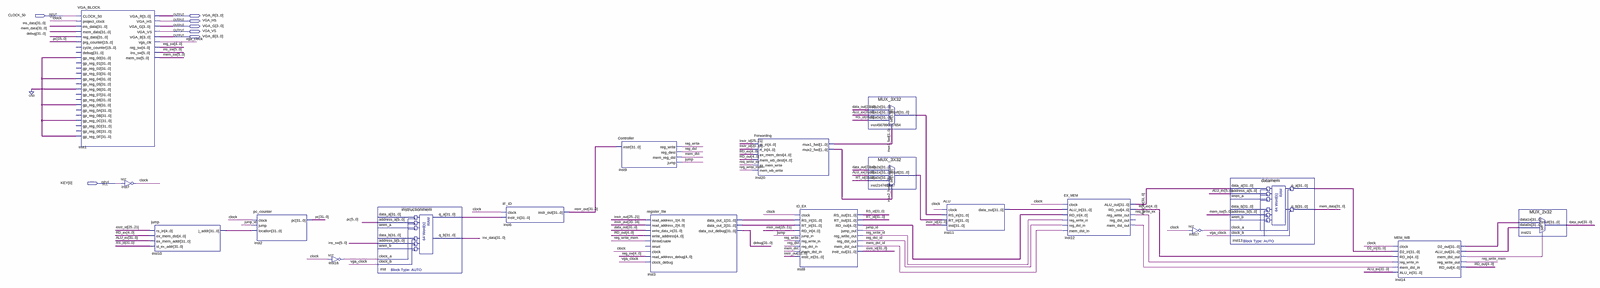
[diagram p0: schematic sheet, whole]
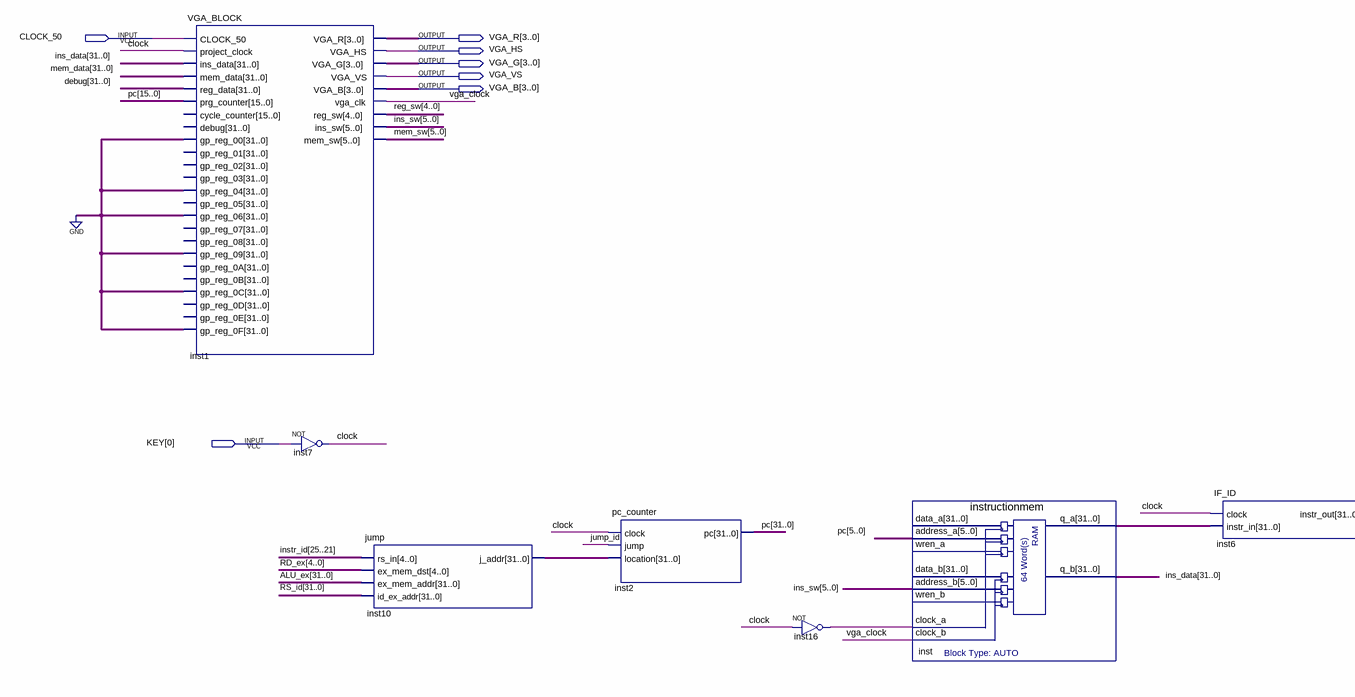
[diagram p1: schematic sheet, left part]
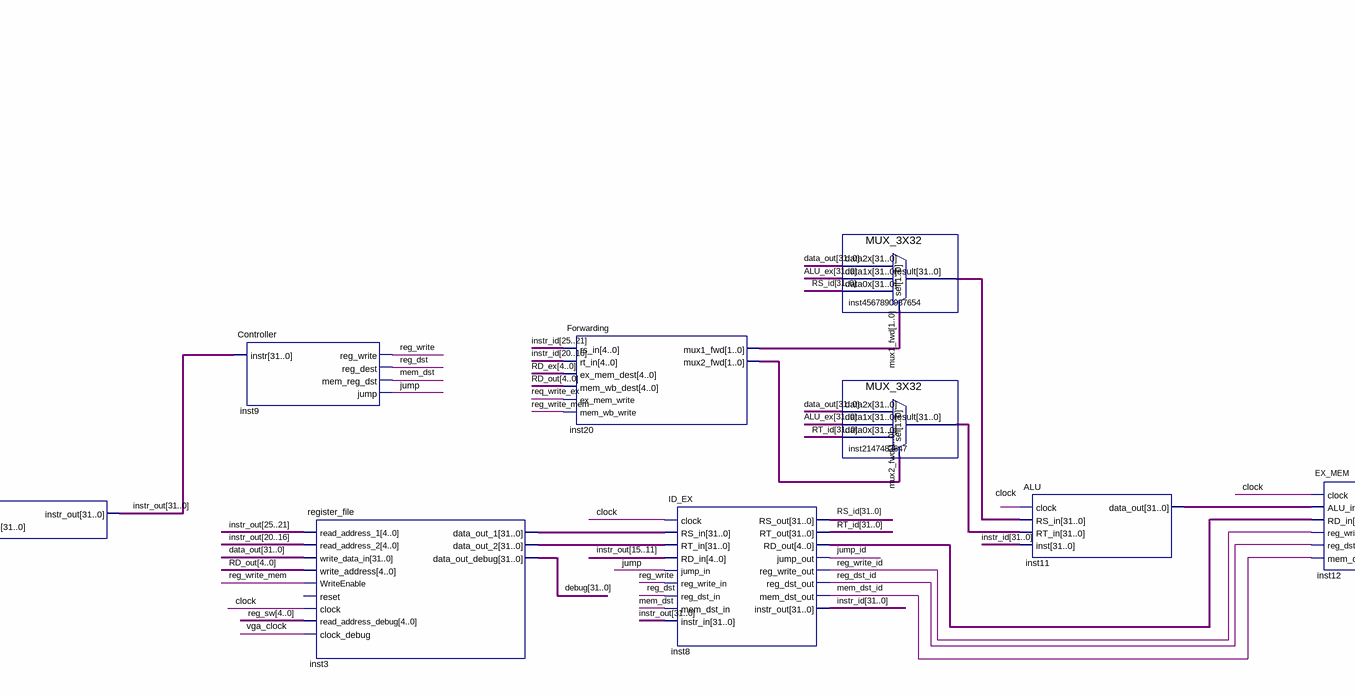
[diagram p2: schematic sheet, centre part]
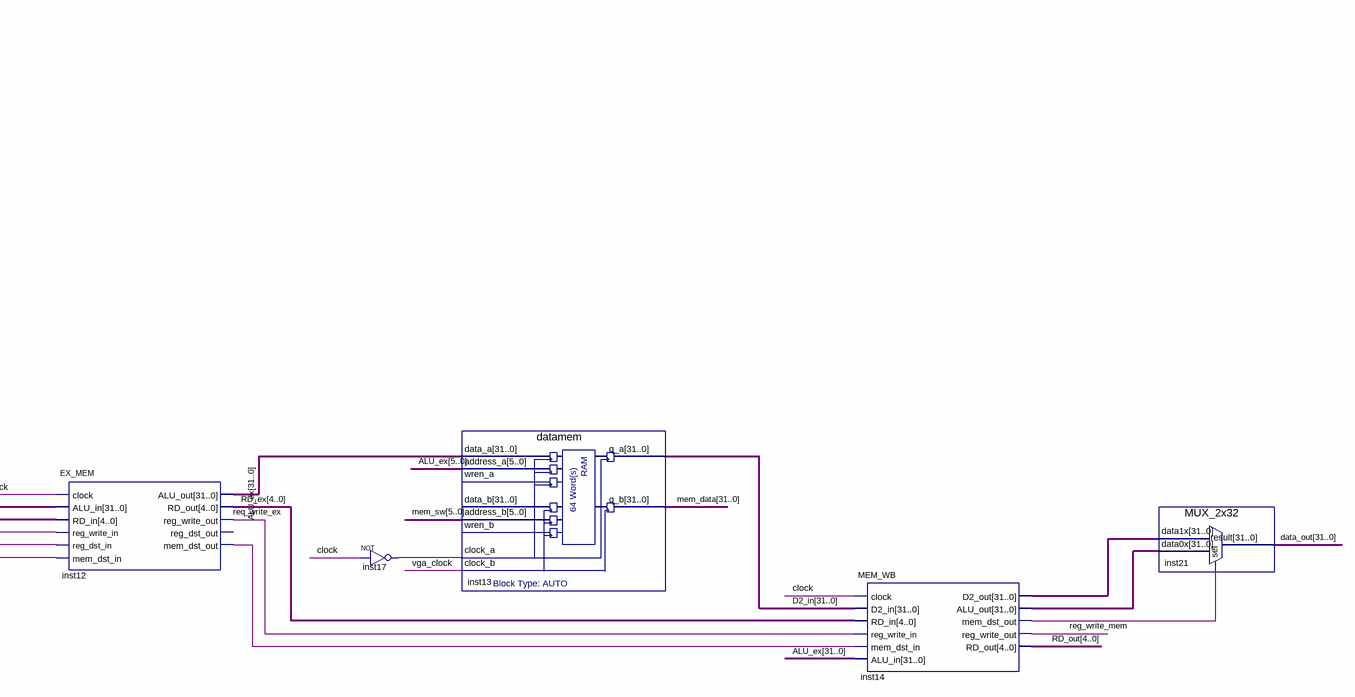
[diagram p3: schematic sheet, right part]
// Quartus schematic project.bdf as structural Verilog: 19 symbols, 7 pins
module project (
  input  CLOCK_50,
  input  [0:0] KEY,
  output [3:0] VGA_R,
  output VGA_HS,
  output [3:0] VGA_G,
  output VGA_VS,
  output [3:0] VGA_B
);

  wire clock, inst12_mem_dst_out, inst14_mem_dst_out, inst16_out, inst17_out, jump, jump_id, mem_dst,
       mem_dst_id, reg_dst, reg_dst_id, reg_write, reg_write_id, reg_write_mem, req_write_ex, vga_clock;
  wire [1:0] mux1_fwd, mux2_fwd;
  wire [4:0] inst8_rd_out, RD_ex, RD_out, reg_sw;
  wire [5:0] ins_sw, mem_sw;
  wire [31:0] ALU_ex, D2_in, data_out, debug, ins_data, inst3_data_out_1, inst3_data_out_2, inst10_j_addr,
       inst11_data_out, inst14_alu_out, inst14_d2_out, inst2147483647_result, inst4567890987654_result,
       inst_q_a, instr_id, instr_out, mem_data, pc, RS_id, RT_id;

  VGA_BLOCK inst1 (
    .CLOCK_50(CLOCK_50), .project_clock(clock), .ins_data(ins_data), .mem_data(mem_data), .reg_data(debug),
    .prg_counter(pc[15:0]), .gp_reg_00({32{1'b0}}), .gp_reg_04({32{1'b0}}), .gp_reg_06({32{1'b0}}),
    .gp_reg_09({32{1'b0}}), .gp_reg_0C({32{1'b0}}), .gp_reg_0F({32{1'b0}}), .VGA_R(VGA_R), .VGA_HS(VGA_HS),
    .VGA_G(VGA_G), .VGA_VS(VGA_VS), .VGA_B(VGA_B), .vga_clk(vga_clock), .reg_sw(reg_sw), .ins_sw(ins_sw),
    .mem_sw(mem_sw));  // open: cycle_counter, debug, gp_reg_01, gp_reg_02, gp_reg_03, gp_reg_05, gp_reg_07, gp_reg_08, gp_reg_0A, gp_reg_0B, gp_reg_0D, gp_reg_0E
  not inst7 (clock, KEY[0]);
  jump inst10 (
    .rs_in(instr_id[25:21]), .ex_mem_dst(RD_ex), .ex_mem_addr(ALU_ex), .id_ex_addr(RS_id),
    .j_addr(inst10_j_addr));
  pc_counter inst2 (.clock(clock), .jump(jump_id), .location(inst10_j_addr), .pc(pc));
  not inst16 (inst16_out, clock);
  instructionmem inst (
    .address_a(pc[5:0]), .address_b(ins_sw), .clock_a(inst16_out), .clock_b(vga_clock), .q_a(inst_q_a),
    .q_b(ins_data));  // open: data_a, wren_a, data_b, wren_b
  IF_ID inst6 (.clock(clock), .instr_in(inst_q_a), .instr_out(instr_out));
  Controller inst9 (.instr(instr_out), .reg_write(reg_write), .reg_dest(reg_dst), .mem_reg_dst(mem_dst), .jump(jump));
  register_file inst3 (
    .read_address_1(instr_out[25:21]), .read_address_2(instr_out[20:16]), .write_data_in(data_out),
    .write_address(RD_out), .WriteEnable(reg_write_mem), .clock(clock), .read_address_debug(reg_sw),
    .clock_debug(vga_clock), .data_out_1(inst3_data_out_1), .data_out_2(inst3_data_out_2),
    .data_out_debug(debug));  // open: reset
  Forwarding inst20 (
    .rs_in(instr_id[25:21]), .rt_in(instr_id[20:16]), .ex_mem_dest(RD_ex), .mem_wb_dest(RD_out),
    .ex_mem_write(req_write_ex), .mem_wb_write(reg_write_mem), .mux1_fwd(mux1_fwd), .mux2_fwd(mux2_fwd));
  ID_EX inst8 (
    .clock(clock), .RS_in(inst3_data_out_1), .RT_in(inst3_data_out_2), .RD_in(instr_out[15:11]),
    .jump_in(jump), .reg_write_in(reg_write), .reg_dst_in(reg_dst), .mem_dst_in(mem_dst),
    .instr_in(instr_out), .RS_out(RS_id), .RT_out(RT_id), .RD_out(inst8_rd_out), .jump_out(jump_id),
    .reg_write_out(reg_write_id), .reg_dst_out(reg_dst_id), .mem_dst_out(mem_dst_id), .instr_out(instr_id));
  MUX_3X32 inst4567890987654 (
    .data2x(data_out), .data1x(ALU_ex), .data0x(RS_id), .sel(mux1_fwd), .result(inst4567890987654_result));
  MUX_3X32 inst2147483647 (
    .data2x(data_out), .data1x(ALU_ex), .data0x(RT_id), .sel(mux2_fwd), .result(inst2147483647_result));
  ALU inst11 (
    .clock(clock), .RS_in(inst4567890987654_result), .RT_in(inst2147483647_result), .inst(instr_id),
    .data_out(inst11_data_out));
  EX_MEM inst12 (
    .clock(clock), .ALU_in(inst11_data_out), .RD_in(inst8_rd_out), .reg_write_in(reg_write_id),
    .reg_dst_in(reg_dst_id), .mem_dst_in(mem_dst_id), .ALU_out(ALU_ex), .RD_out(RD_ex),
    .reg_write_out(req_write_ex), .mem_dst_out(inst12_mem_dst_out));  // open: reg_dst_out
  not inst17 (inst17_out, clock);
  datamem inst13 (
    .data_a(ALU_ex), .address_a(ALU_ex[5:0]), .address_b(mem_sw), .clock_a(inst17_out), .clock_b(vga_clock),
    .q_a(D2_in), .q_b(mem_data));  // open: wren_a, data_b, wren_b
  MEM_WB inst14 (
    .clock(clock), .D2_in(D2_in), .RD_in(RD_ex), .reg_write_in(req_write_ex),
    .mem_dst_in(inst12_mem_dst_out), .ALU_in(ALU_ex), .D2_out(inst14_d2_out), .ALU_out(inst14_alu_out),
    .mem_dst_out(inst14_mem_dst_out), .reg_write_out(reg_write_mem), .RD_out(RD_out));
  MUX_2x32 inst21 (.data1x(inst14_d2_out), .data0x(inst14_alu_out), .sel(inst14_mem_dst_out), .result(data_out));
endmodule
